# Altium schematic sheet Logic_Power.SchDoc
size A
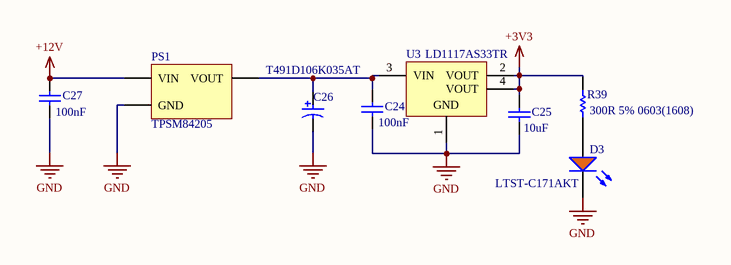
[diagram p0: Logic_Power.SchDoc]

## Parts
C24  100nF  [CAPC0805(2012)145_L]
C25  10uF  [CAPC0805(2012)145_L]
C26  T491D106K035AT  [KEMT-T491-D_L]
C27  100nF  [CAPC0805(2012)145_L]
D3  LTST-C171AKT  [LTST-C171AKT_V]
PS1  TPSM84205  [tpsm84205]
R39  300R 5% 0603(1608)  [RESC0603(1608)_N]
U3  LD1117AS33TR  [SOT-223_M]

## Nets
+3V3: C25.2 R39.2 U3.2(VOUT) U3.4(VOUT)
+12V: C27.2 PS1.1(VIN)
GND: C24.1 C25.1 C26.2 C27.1 D3.C PS1.2(GND) U3.1(GND)
NetC24_2: C24.2 C26.1 PS1.3(VOUT) U3.3(VIN)
NetD3_A: D3.A R39.1

## Library data of the parts
C24 C25 C27 = CMP-1590-00003-1: 0805 (2012 Metric) Chip Capacitor; Case-EIA: 0805; Case-Metric: 2012; PackageReference: CAPC0805(2012)145
  C24 C27: Value: 100nF
  C25: Value: 10uF
C26 = CMP-2000-07580-1: Tantalum Capacitor, 10 uF, +/- 10%, 35 V, -55 to 125 degC, 2-Pin SMD, RoHS, Tape and Reel; Manufacturer: Kemet; Capacitance: 10uF; Leakage Current: 3.5uA; Dissipation Factor: 6%; Case\/Package: 2917; Polarity: Polar; Voltage Rating: 35V; ESR (Equivalent Series Resistance): 1Ohm; Life (Hours): 2000Hour; Tolerance: 20%; Max Operating Temperature: 125degC; Length: 7.3mm; Depth: 4.3mm; Termination: SMD/SMT; Case Code (Metric): 7343; Number of Pins: 2; Package Reference: T491-D; Width: 4.3mm; RoHSCompliant: True; Lead Free: LeadFree; Radiation Hardening: No; Height: 2.8mm; Voltage Rating (DC): 35V; REACH SVHC: NoSVHC; Datasheet URL: http://www.kemet.com/Lists/ProductCatalog/Attachments/254/KEM_T2005_T491.pdf; Datasheet Version: 07/2017; Manufacturer URL: http://www.kemet.com/; Mounting Technology: SurfaceMount; Min Operating Temperature: -55degC; Case Code (Imperial): 2917; Package Quantity: 1; Packaging: TapeandReel; Package Description: 2-Pin Surface Mount Device, Body 7.3 x 4.3 mm; Height - Seated (Max): 0.122inch; Voltage: 35V; Dielectric Material: Tantalum; Mount: PCB
D3 = CMP-1674-00004-3: LED AMBER CLR THIN 0805 SMD; Manufacturer: Lite-On; PartNumber: LTST-C171AKT; ComponentLink1URL: http://optoelectronics.liteon.com/upload/download/DS-22-99-0170/S_110_LTST-C171AKT.pdf; PackageReference: C171AKT; ComponentLink1Description: Datasheet
R39 = CMP-1012-00122-1: 100K 0.1W 5% 0603 (1608 Metric)  SMD; Case-EIA: 0603; Value: 100000.00 Ohm; Case-Metric: 1608; Tolerance: 5 %; Power: 0.1 W; Technology: SMT
U3 = CMP-0244-00316-1: 1A, Low Drop Positive Voltage Regulator, 3.3V, 4-Pin SOT-223, Tape and Reel; ComponentLink1Description: Manufacturer URL; DatasheetVersion: 2/12/2011; PackageVersion: 2010; ComponentLink1URL: http://www.st.com; ComponentLink2Description: Datasheet; ComponentLink2URL: http://www.st.com/internet/com/TECHNICAL_RESOURCES/TECHNICAL_LITERATURE/DATASHEET/CD00002116.pdf; PackageDescription: 4-Pin SOT-223 Package, 6.5 x 3.5 mm Body, 2.3 mm Pitch, 7 mm Lead Span; PackageReference: SOT-223